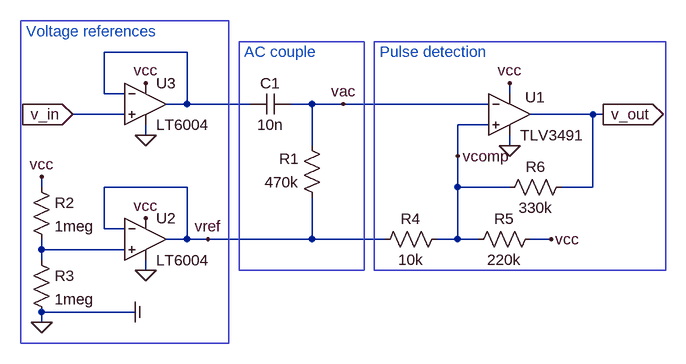
[diagram p0: schematic frontend.asc]
frontend.asc, the LTspice schematic file:
Version 4
SHEET 1 920 680
WIRE -336 -432 -464 -432
WIRE -464 -368 -464 -432
WIRE -432 -368 -464 -368
WIRE 160 -368 160 -384
WIRE -336 -352 -336 -432
WIRE -336 -352 -368 -352
WIRE -240 -352 -336 -352
WIRE -144 -352 -176 -352
WIRE -96 -352 -144 -352
WIRE 128 -352 -96 -352
WIRE -432 -336 -512 -336
WIRE 288 -336 192 -336
WIRE 304 -336 288 -336
WIRE 128 -320 80 -320
WIRE -400 -304 -400 -320
WIRE -144 -288 -144 -352
WIRE 160 -288 160 -304
WIRE 80 -272 80 -320
WIRE -560 -224 -560 -240
WIRE -336 -224 -464 -224
WIRE 80 -224 80 -272
WIRE 160 -224 80 -224
WIRE 288 -224 288 -336
WIRE 288 -224 240 -224
WIRE -464 -160 -464 -224
WIRE -432 -160 -464 -160
WIRE -336 -144 -336 -224
WIRE -336 -144 -368 -144
WIRE -304 -144 -336 -144
WIRE -144 -144 -144 -208
WIRE -144 -144 -304 -144
WIRE -32 -144 -144 -144
WIRE 80 -144 80 -224
WIRE 80 -144 48 -144
WIRE 112 -144 80 -144
WIRE 224 -144 192 -144
WIRE -560 -128 -560 -144
WIRE -432 -128 -560 -128
WIRE -560 -112 -560 -128
WIRE -400 -96 -400 -112
WIRE -416 -32 -560 -32
WIRE -560 -16 -560 -32
FLAG 160 -384 vcc
FLAG 160 -288 0
FLAG 304 -336 v_out
IOPIN 304 -336 Out
FLAG -96 -352 vac
FLAG -560 -240 vcc
FLAG -400 -176 vcc
FLAG -400 -96 0
FLAG -304 -144 vref
FLAG 80 -272 vcomp
FLAG 224 -144 vcc
FLAG -512 -336 v_in
IOPIN -512 -336 In
FLAG -400 -384 vcc
FLAG -400 -304 0
FLAG -560 -16 0
FLAG -416 -32 COM
SYMBOL res -128 -192 R180
WINDOW 0 36 76 Left 2
WINDOW 3 36 40 Left 2
SYMATTR InstName R1
SYMATTR Value 470k
SYMBOL cap -176 -368 R90
WINDOW 0 0 32 VBottom 2
WINDOW 3 32 32 VTop 2
SYMATTR InstName C1
SYMATTR Value 10n
SYMBOL res -576 -240 R0
SYMATTR InstName R2
SYMATTR Value 1meg
SYMATTR SpiceLine tol=2 pwr=0.25
SYMBOL res -576 -128 R0
SYMATTR InstName R3
SYMATTR Value 1meg
SYMATTR SpiceLine tol=2 pwr=0.25
SYMBOL SBORKA\\COMPARATOR\\TLV3491 160 -336 R0
WINDOW 38 12 37 Left 2
WINDOW 0 24 -26 Left 2
SYMATTR InstName U1
SYMBOL Opamps\\LT6004 -400 -144 R0
SYMATTR InstName U2
SYMBOL res 64 -160 R90
WINDOW 0 0 56 VBottom 2
WINDOW 3 32 56 VTop 2
SYMATTR InstName R4
SYMATTR Value 10k
SYMBOL res 208 -160 R90
WINDOW 0 0 56 VBottom 2
WINDOW 3 32 56 VTop 2
SYMATTR InstName R5
SYMATTR Value 220k
SYMBOL res 256 -240 R90
WINDOW 0 0 56 VBottom 2
WINDOW 3 32 56 VTop 2
SYMATTR InstName R6
SYMATTR Value 330k
SYMBOL Opamps\\LT6004 -400 -352 R0
SYMATTR InstName U3
TEXT -584 -464 Left 2 ;Voltage references
TEXT -40 -432 Left 2 ;Pulse detection
TEXT -248 -432 Left 2 ;AC couple
RECTANGLE Normal -272 16 -592 -480
RECTANGLE Normal 400 -448 -48 -96
RECTANGLE Normal -64 -448 -256 -96

The netlist it stands for:
* frontend.asc
R1 vref vac 470k
C1 vac N001 10n
R2 vcc N002 1meg tol=2 pwr=0.25
R3 N002 0 1meg tol=2 pwr=0.25
* U1: TLV3491 (symbol SBORKA\COMPARATOR\TLV3491 not available, pins judged from their places): In+=vcomp In-=vac V+=vcc V-=0 OUT=v_out
* U2: LT6004 (symbol Opamps\LT6004 not available, pins judged from their places): In+=N002 In-=vref V+=vcc V-=0 OUT=vref
R4 vcomp vref 10k
R5 vcc vcomp 220k
R6 v_out vcomp 330k
* U3: LT6004 (symbol Opamps\LT6004 not available, pins judged from their places): In+=v_in In-=N001 V+=vcc V-=0 OUT=N001
* Voltage references
* Pulse detection
* AC couple
.backanno
.end